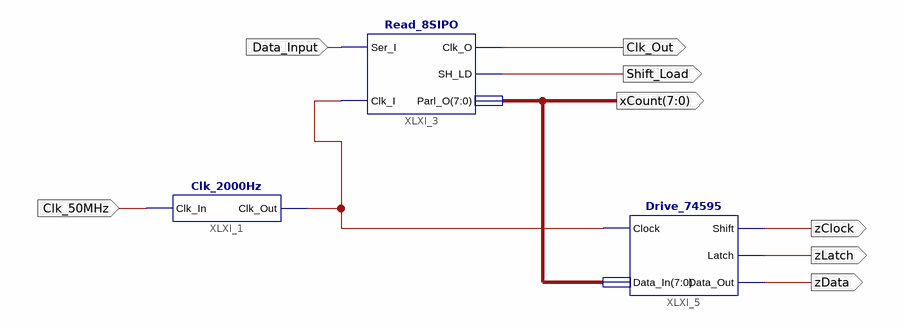
[diagram p0: schematic sheet 1]
// Xilinx ISE schematic FFF.sch (spartan6) as structural Verilog: 3 symbols, 8 ports
module FFF (
  input  Clk_50MHz,
  input  Data_Input,
  output Clk_Out,
  output Shift_Load,
  output [7:0] xCount,
  output zClock,
  output zLatch,
  output zData
);

  wire XLXN_19;

  Clk_2000Hz XLXI_1 (.Clk_In(Clk_50MHz), .Clk_Out(XLXN_19));
  Read_8SIPO XLXI_3 (.Ser_I(Data_Input), .Clk_I(XLXN_19), .Clk_O(Clk_Out), .SH_LD(Shift_Load), .Parl_O(xCount));
  Drive_74595 XLXI_5 (.Clock(XLXN_19), .Data_In(xCount), .Shift(zClock), .Latch(zLatch), .Data_Out(zData));
endmodule
